# Altium schematic sheet PCM2912_CODEC_MAIN.SchDoc
size A4
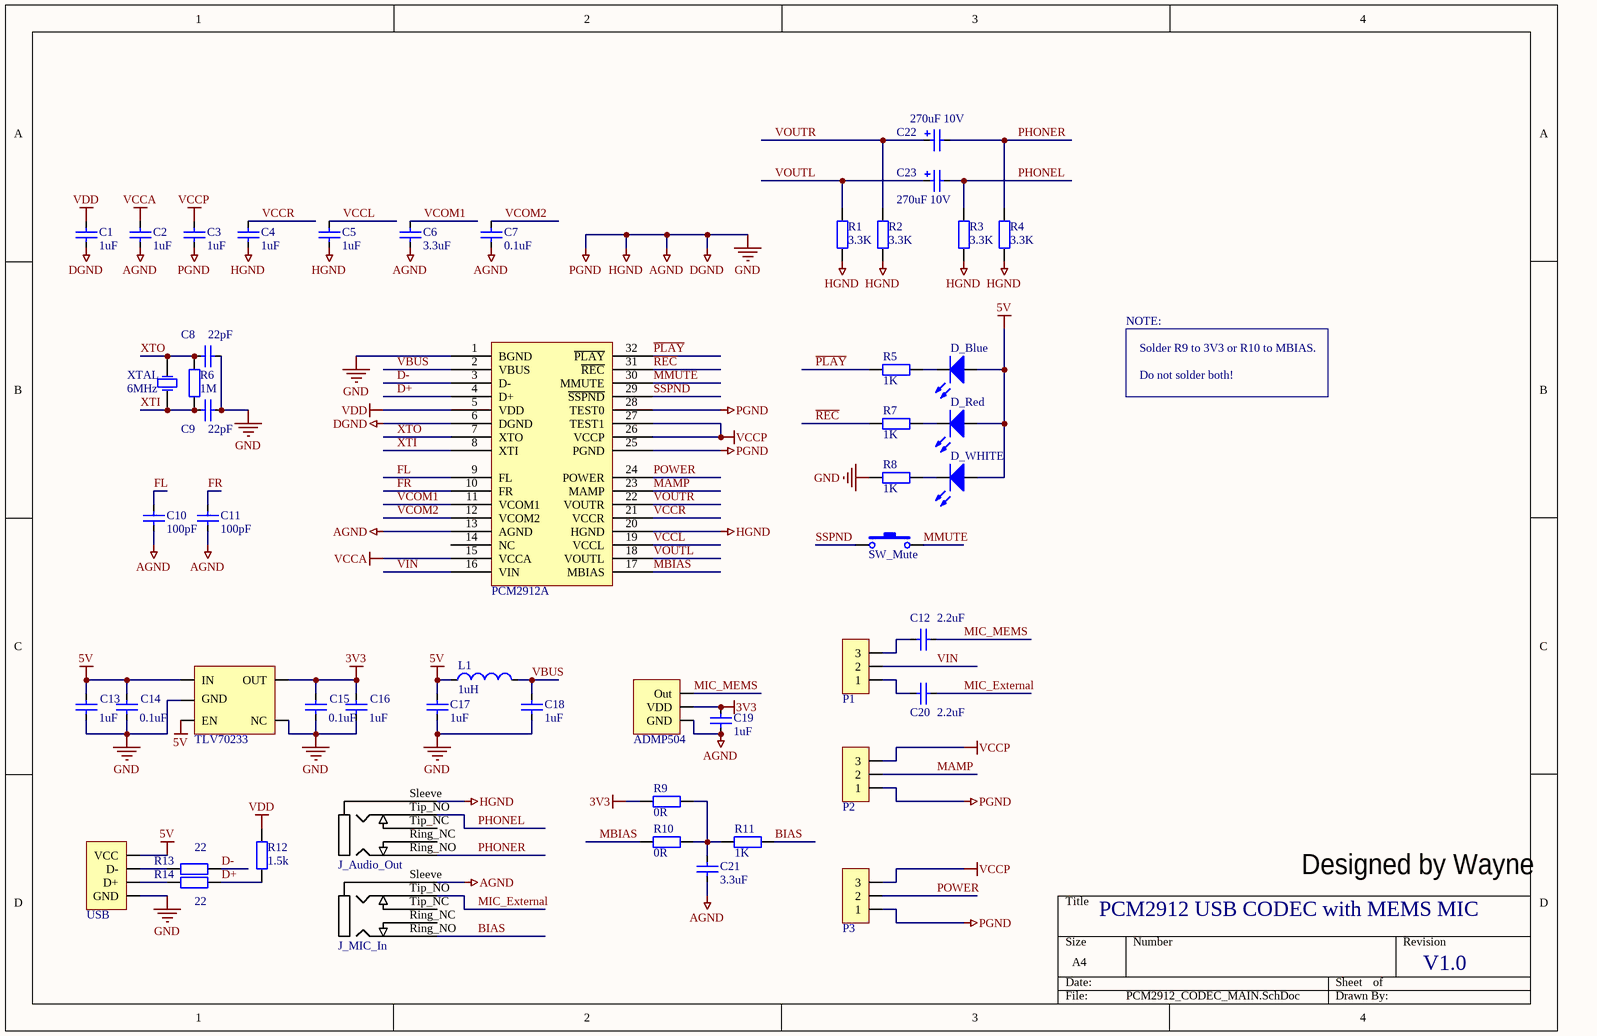
[diagram p0: PCM2912_CODEC_MAIN.SchDoc]

## Parts
ADMP504  ADMP504  [ADMP504]  (value not drawn)
C1  value 1uF  [CAP_0603]  (hidden comment: Cap_0603)
C2  value 1uF  [CAP_0603]  (hidden comment: Cap_0603)
C3  value 1uF  [CAP_0603]  (hidden comment: Cap_0603)
C4  value 1uF  [CAP_0603]  (hidden comment: Cap_0603)
C5  value 1uF  [CAP_0603]  (hidden comment: Cap_0603)
C6  value 3.3uF  [CAP_0603]  (hidden comment: Cap_0603)
C7  value 0.1uF  [CAP_0603]  (hidden comment: Cap_0603)
C8  value 22pF  [CAP_0603]  (hidden comment: Cap_0603)
C9  value 22pF  [CAP_0603]  (hidden comment: Cap_0603)
C10  value 100pF  [CAP_0603]  (hidden comment: Cap_0603)
C11  value 100pF  [CAP_0603]  (hidden comment: Cap_0603)
C12  value 2.2uF  [CAP_0603]  (hidden comment: Cap_0603)
C13  value 1uF  [CAP_0603]  (hidden comment: Cap_0603)
C14  value 0.1uF  [CAP_0603]  (hidden comment: Cap_0603)
C15  value 0.1uF  [CAP_0603]  (hidden comment: Cap_0603)
C16  value 1uF  [CAP_0603]  (hidden comment: Cap_0603)
C17  value 1uF  [CAP_0603]  (hidden comment: Cap_0603)
C18  value 1uF  [CAP_0603]  (hidden comment: Cap_0603)
C19  value 1uF  [CAP_0603]  (hidden comment: Cap_0603)
C20  value 2.2uF  [CAP_0603]  (hidden comment: Cap_0603)
C21  value 3.3uF  [CAP_0603]  (hidden comment: Cap_0603)
C22  value 270uF 10V  [CAP_ELEC_F3.5_D8_H11.5]  (hidden comment: Capacitor)
C23  value 270uF 10V  [CAP_ELEC_F3.5_D8_H11.5]  (hidden comment: Capacitor)
D_Blue  LED_0603_BLUE  [LED_0603_BLUE]  (value not drawn)
D_Red  LED_0603_RED  [LED_0603_RED]  (value not drawn)
D_WHITE  LED_0603_WHITE  [LED_0603_WHITE]  (value not drawn)
J_Audio_Out  Generic 3.5 PhoneJack 5 Pin through-hole  [3.5 PhoneJack 5 Pin]  (value not drawn)
J_MIC_In  Generic 3.5 PhoneJack 5 Pin through-hole  [3.5 PhoneJack 5 Pin]  (value not drawn)
L1  value 1uH  [IND_0603]  (hidden comment: Ind_0603)
P1  HDR1X3_90_2.54  [HDR1X3_90_2.54]  (value not drawn)
P2  HDR1X3_90_2.54  [HDR1X3_90_2.54]  (value not drawn)
P3  HDR1X3_90_2.54  [HDR1X3_90_2.54]  (value not drawn)
PCM2912A  PCM2912A  [TI-S-PQFP-N32]  (value not drawn)
R1  value 3.3K  [RES_0603]  (hidden comment: Res_0603)
R2  value 3.3K  [RES_0603]  (hidden comment: Res_0603)
R3  value 3.3K  [RES_0603]  (hidden comment: Res_0603)
R4  value 3.3K  [RES_0603]  (hidden comment: Res_0603)
R5  value 1K  [RES_0603]  (hidden comment: Res_0603)
R6  value 1M  [RES_0603]  (hidden comment: Res_0603)
R7  value 1K  [RES_0603]  (hidden comment: Res_0603)
R8  value 1K  [RES_0603]  (hidden comment: Res_0603)
R9  value 0R  [RES_0603]  (hidden comment: Res_0603)
R10  value 0R  [RES_0603]  (hidden comment: Res_0603)
R11  value 1K  [RES_0603]  (hidden comment: Res_0603)
R12  value 1.5k  [RES_0603]  (hidden comment: Res_0603)
R13  value 22  [RES_0603]  (hidden comment: Res_0603)
R14  value 22  [RES_0603]  (hidden comment: Res_0603)
SW_Mute  TACT Swtich SMT 6*6  [TACT Switch SMT 6*6]  (value not drawn)
TLV70233  TLV70233  [SOT23-5]  (value not drawn)
USB  USB  [USB]  (value not drawn)
XTAL  value 6MHz  [XTAL_5032]  (hidden comment: XTAL_5032)

## Nets
3V3: ADMP504.3(VDD) C15.1 C16.1 C19.2 R9.1 TLV70233.5(OUT)
5V: C13.1 C14.1 C17.2 D_Blue.1(A) D_Red.1(A) D_WHITE.1(A) L1.1 TLV70233.1(IN) TLV70233.3(EN) USB.1(VCC)
AGND: ADMP504.2(GND) C1.1 C2.1 C3.1 C4.1 C5.1 C6.1 C7.1 C8.1 C9.1 C10.1 C11.1 C13.2 C14.2 C15.2 C16.2 C17.1 C18.1 C19.1 C21.1 J_Audio_Out.Sleeve J_MIC_In.Sleeve P2.1 P3.1 PCM2912A.1(BGND) PCM2912A.6(DGND) PCM2912A.13(AGND) PCM2912A.20(HGND) PCM2912A.25(PGND) PCM2912A.28(TEST0) R1.2 R2.2 R3.2 R4.2 R8.2 TLV70233.2(GND) TLV70233.4(NC) USB.4(GND)  [also labelled DGND, GND, HGND, PGND]
VCCA: C2.2 PCM2912A.15(VCCA)
VCCP: C3.2 P2.3 P3.3 PCM2912A.26(VCCP) PCM2912A.27(TEST1)
VDD: C1.2 PCM2912A.5(VDD) R12.1
BIAS: J_MIC_In.Ring_NO R11.1
D+: PCM2912A.4(D+) R12.2 R14.2
D-: PCM2912A.3(D-) R13.2
FL: C10.2 PCM2912A.9(FL)
FR: C11.2 PCM2912A.10(FR)
MAMP: P2.2 PCM2912A.23(MAMP)
MBIAS: PCM2912A.17(MBIAS) R10.1
MIC_External: C20.2 J_MIC_In.Tip_NO
MIC_MEMS: ADMP504.1(Out) C12.2
MMUTE: PCM2912A.30(MMUTE) SW_Mute.2
~{PLAY}: PCM2912A.32(~{PLAY}) R5.2
PHONEL: C23.2 J_Audio_Out.Tip_NO R3.1
PHONER: C22.2 J_Audio_Out.Ring_NO R4.1
POWER: P3.2 PCM2912A.24(POWER)
~{REC}: PCM2912A.31(~{REC}) R7.2
SSPND: PCM2912A.29(~{SSPND}) SW_Mute.1
VBUS: C18.2 L1.2 PCM2912A.2(VBUS)
VCCL: C5.2 PCM2912A.19(VCCL)
VCCR: C4.2 PCM2912A.21(VCCR)
VCOM1: C6.2 PCM2912A.11(VCOM1)
VCOM2: C7.2 PCM2912A.12(VCOM2)
VIN: P1.2 PCM2912A.16(VIN)
VOUTL: C23.1 PCM2912A.18(VOUTL) R1.1
VOUTR: C22.1 PCM2912A.22(VOUTR) R2.1
XTI: C9.2 PCM2912A.8(XTI) R6.2 XTAL.1(OSC1)
XTO: C8.2 PCM2912A.7(XTO) R6.1 XTAL.2(OSC2)
NetC12_1: C12.1 P1.3
NetC20_1: C20.1 P1.1
NetC21_2: C21.2 R9.2 R10.2 R11.2
NetD_Blue_2: D_Blue.2(K) R5.1
NetD_Red_2: D_Red.2(K) R7.1
NetD_WHITE_2: D_WHITE.2(K) R8.1
NetR13_1: R13.1 USB.2(D-)
NetR14_1: R14.1 USB.3(D+)

Not connected (* = marked no-connect by the designer): J_Audio_Out Ring_NC Tip_NC; J_MIC_In Ring_NC Tip_NC; PCM2912A 14(NC)

## Notes on the sheet
- NOTE:
- Solder R9 to 3V3 or R10 to MBIAS.
- Do not solder both!
- PCM2912 USB CODEC with MEMS MIC
- Designed by Wayne
- V1.0

## Library data of the parts
ADMP504 = ADMP504: ADMP504 Analog Output MEMS Microphone
C1-C21 = Cap_0603: Capacitor
C22 C23 = Cap_ELEC_8*11.5*3.5
D_Blue = LED_0603_BLUE: LED
D_Red = LED_0603_RED: LED
D_WHITE = LED_0603_WHITE: LED
L1 = Ind_0603: Inductor
P1-P3 = HDR1X3_90_2.54: Header
PCM2912A = PCM2912A: PCM2912A USB CODEC
R1-R14 = Res_0603: Resistor
TLV70233 = TLV70233: 300mA LDO SOT-23
XTAL = XTAL_5032: Crystal Oscillator; Published: 8-Jun-2000; LatestRevisionDate: 17-Jul-2002; LatestRevisionNote: Re-released for DXP Platform.; PackageReference: R38; Publisher: Altium Limited; PackageDescription: Crystal, Thru-Hole; 2 Leads; Body 3.1 x 8.2 mm (Dia.xH)